# Altium schematic sheet Part22_ETH_WAN.SchDoc
size A4
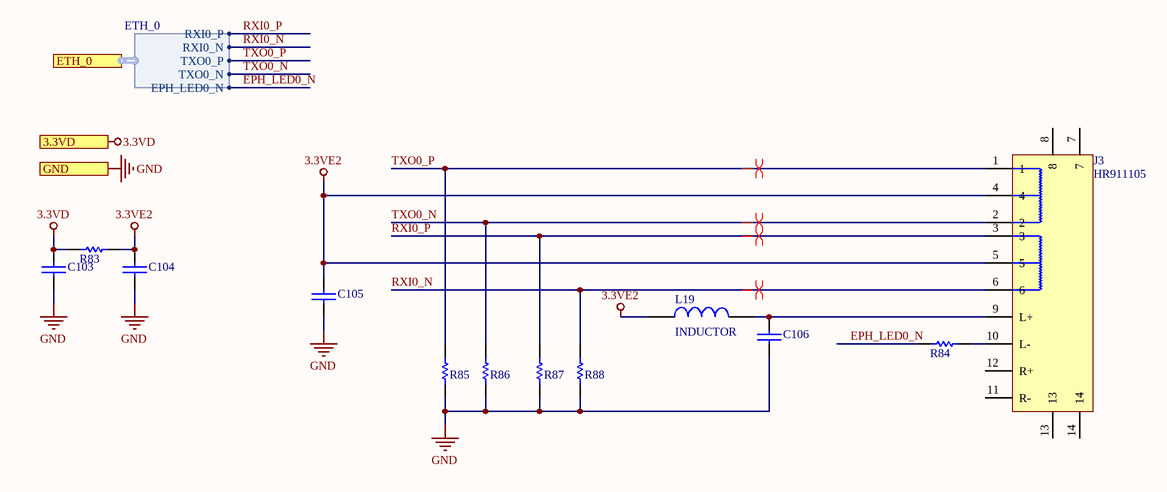
[diagram p0: Part22_ETH_WAN.SchDoc]

## Parts
C103  100nF  [0402C]  (value not drawn)
C104  100nF  [0402C]  (value not drawn)
C105  100nF  [0402C]  (value not drawn)
C106  100nF  [0402C]  (value not drawn)
J3  HR911105  [HR911105A]
L19  INDUCTOR  [0402L]
R83  0R  [0402R]  (value not drawn)
R84  1K  [0402R]  (value not drawn)
R85  49.9R  [0402R]  (value not drawn)
R86  49.9R  [0402R]  (value not drawn)
R87  49.9R  [0402R]  (value not drawn)
R88  49.9R  [0402R]  (value not drawn)

## Ports
3.3VD, ETH_0 (harness ETH_0), GND

## Harnesses
ETH_0: RXI0_P, RXI0_N, TXO0_P, TXO0_N, EPH_LED0_N

## Nets
3.3VD: C103.1 R83.1 ; port 3.3VD
3.3VE2: C104.1 C105.1 J3.4 J3.5 L19.1 R83.2
GND: C103.2 C104.2 C105.2 C106.2 R85.1 R86.1 R87.1 R88.1 ; port GND
EPH_LED0_N: R84.2 ; port ETH_0.EPH_LED0_N
RXI0_N: J3.6 R88.2 ; port ETH_0.RXI0_N
RXI0_P: J3.3 R87.2 ; port ETH_0.RXI0_P
TXO0_N: J3.2 R86.2 ; port ETH_0.TXO0_N
TXO0_P: J3.1 R85.2 ; port ETH_0.TXO0_P
NetC106_1: C106.1 J3.9(L+) L19.2
NetJ3_10: J3.10(L-) R84.1

Not connected (* = marked no-connect by the designer): J3 7 8 11(R-) 12(R+) 13 14

## Layout directives
differential pair: RXI0_N, RXI0_P, TXO0_N, TXO0_P

## Library data of the parts
C103-C106 = CAP: 无极性电容
R83-R88 = RES